# Altium schematic sheet Connectors.SchDoc
size A4; SheetNumber: 2; SheetTotal: 5
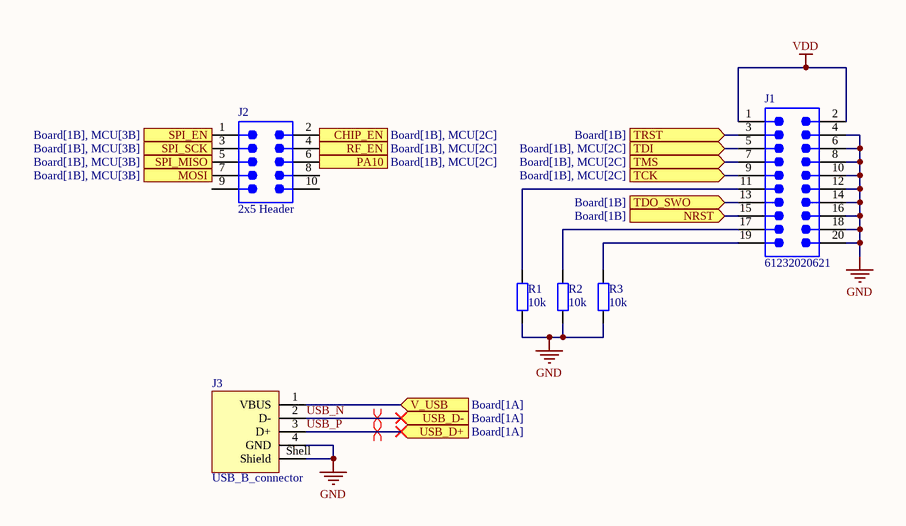
[diagram p0: Connectors.SchDoc]

## Parts
J1  61232020621  [61232020621]
J2  2x5 Header  [SMTC-MMT-105-01-X-DH]
J3  USB_B_connector  [62910416121]
R1  10k  [Res_0402]
R2  10k  [Res_0402]
R3  10k  [Res_0402]

## Ports
CHIP_EN (in, see Board[1B], MCU[2C]), MOSI (in, see Board[1B], MCU[3B]), NRST (in, see Board[1B]), PA10 (in, see Board[1B], MCU[2C]), RF_EN (in, see Board[1B], MCU[2C]), SPI_EN (in, see Board[1B], MCU[3B]), SPI_MISO (in, see Board[1B], MCU[3B]), SPI_SCK (in, see Board[1B], MCU[3B]), TCK (in, see Board[1B], MCU[2C]), TDI (in, see Board[1B], MCU[2C]), TDO_SWO (in, see Board[1B]), TMS (in, see Board[1B], MCU[2C]), TRST (in, see Board[1B]), USB_D+ (in, see Board[1A]), USB_D- (in, see Board[1A]), V_USB (in, see Board[1A])

## Nets
GND: J1.4 J1.6 J1.8 J1.10 J1.12 J1.14 J1.16 J1.18 J1.20 J3.4(GND) J3.Shell(Shield) R1.1 R2.1 R3.1
VDD: J1.1 J1.2
CHIP_EN: J2.2 ; port CHIP_EN
MOSI: J2.7 ; port MOSI
NRST: J1.15 ; port NRST
PA10: J2.6 ; port PA10
RF_EN: J2.4 ; port RF_EN
SPI_EN: J2.1 ; port SPI_EN
SPI_MISO: J2.5 ; port SPI_MISO
SPI_SCK: J2.3 ; port SPI_SCK
TCK: J1.9 ; port TCK
TDI: J1.5 ; port TDI
TDO_SWO: J1.13 ; port TDO_SWO
TMS: J1.7 ; port TMS
TRST: J1.3 ; port TRST
USB_N: J3.2(D-) ; port USB_D-
USB_P: J3.3(D+) ; port USB_D+
V_USB: J3.1(VBUS) ; port V_USB
NetJ1_11: J1.11 R1.2
NetJ1_17: J1.17 R2.2
NetJ1_19: J1.19 R3.2

Not connected (* = marked no-connect by the designer): J2 8 9 10

## Layout directives
differential pair: USB_N, USB_P

## Library data of the parts
J1 = 2x10 JTAG: NexarPartId: 32855514; Insulation Resistance: 1GΩ; Operating Supply Voltage: 250V; Contact Resistance: 20mΩ; Gender: Male; Current Rating: 3A; Number of Positions: 20; Connector Type: Male Pin; Pitch: 2.54mm; Mount: Surface Mount; Contact Mating Length: 5.0038mm; REACH SVHC: Unknown; Packaging: Tape and Reel; Contact Plating: Gold; Length: 30.72mm; Number of Rows: 2; Color: Black; Termination: Solder; Orientation: Vertical; Max Operating Temperature: 125°C; Contact Material: Copper; Lead Pitch: 2.54mm; Number of Contacts: 20; RoHS: Compliant; Number of Pins: 20; Min Operating Temperature: -40°C; Row Spacing: 2.54mm
J2 = 2x5 Header: Horizontal Surface Mount Header, -55 to 125 degC, 2 mm Pitch, 10-Pin, Male, RoHS; PartNumber: MMT-105-01-F-DH; Manufacturer: Samtec; Pitch: 2 mm; ComponentLink3Description: Package Specification; ComponentLink2URL: http://d2a072wq521u33.cloudfront.net/catalog_english//MMT_SM.PDF; PackageDescription: 2mm Horizontal Terminal Surface Mount Strip ASSEM; ComponentLink1Description: Manufacturer URL; ComponentLink3URL: http://www.samtec.com/documents/webfiles/cpdf/MMT-1XX-XX-XX-XX-XX-XXX-X-XX-MKT.pdf; RoHS: True; ComponentLink2Description: Datasheet; DatasheetVersion: F-214; ComponentLink1URL: http://www.samtec.com; PackageReference: MMT-105-01-X-DH; Mounting Technology: Surface Mount; Temperature Range: -55 to 125 degC; Orientation: Horizontal; PackageVersion: CY, 12/2000
J3 = USB_B_connector: NexarPartId: 19991172; Contact Resistance: 20mΩ; Connector Type: USB; Number of Contacts: 4; Gender: Receptacle; Current Rating: 1.5A; USB Standard: USB 2.0; Operating Supply Voltage: 30V; Insulation Resistance: 1GΩ; Orientation: Horizontal; RoHS: Compliant; Lead Free: Lead Free; Min Operating Temperature: -40°C; Length: 16mm; Number of Pins: 4; Features: Shielded; Contact Plating: Gold; Packaging: Tape and Reel; Max Operating Temperature: 105°C; Termination: SMD/SMT; Mount: Horizontal, Surface Mount; REACH SVHC: Unknown
R1-R3 = Resistor_EU